# EAGLE design Zio Qwiic LoRa Module (EAGLE 9.2.2)
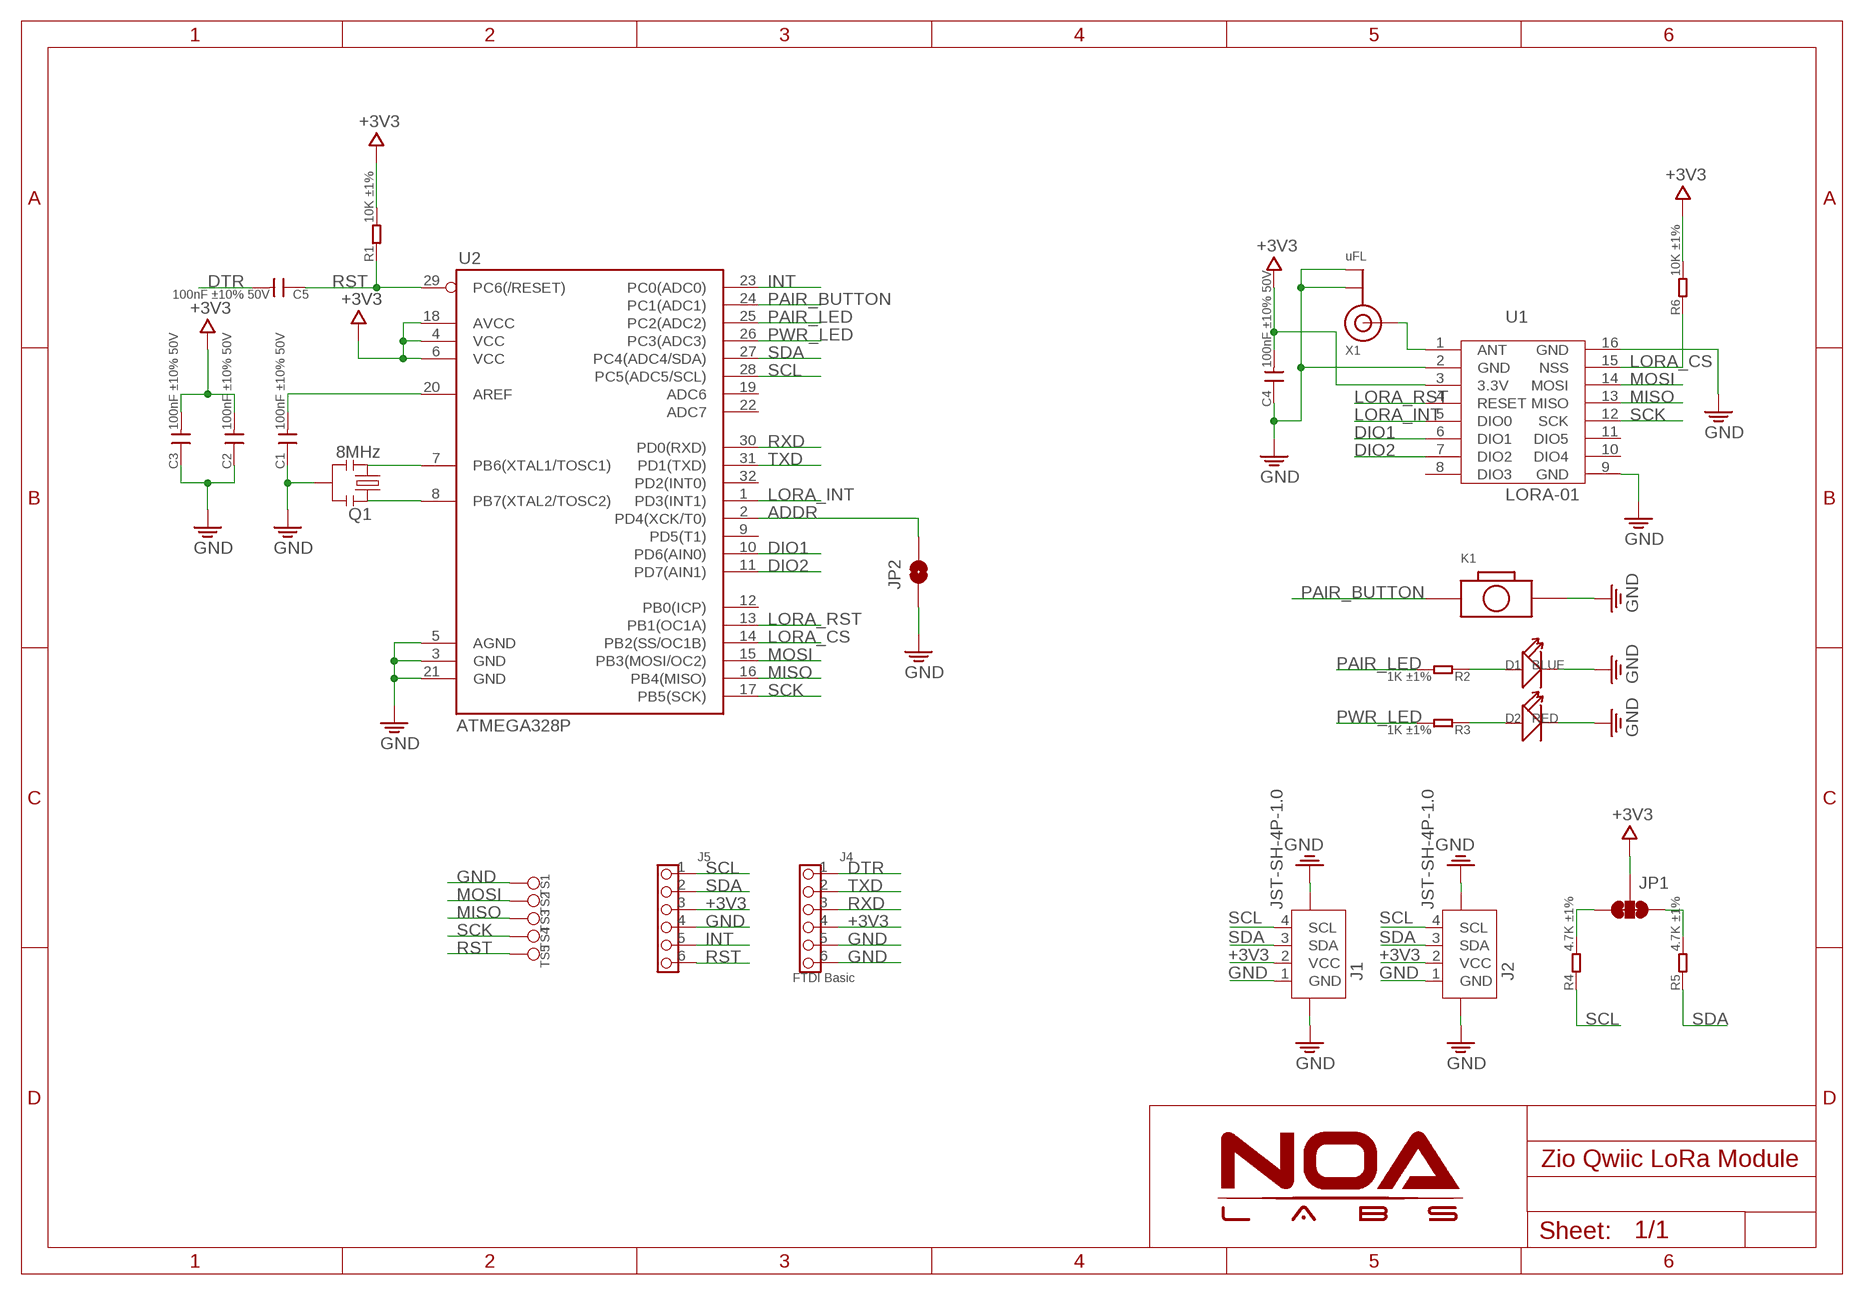
[diagram p0: schematic, sheet 1]

## Parts
C1  100nF ±10% 50V  C-0603  [C0603]
C2  100nF ±10% 50V  C-0603  [C0603]
C3  100nF ±10% 50V  C-0603  [C0603]
C4  100nF ±10% 50V  C-0603  [C0603]
C5  100nF ±10% 50V  C-0603  [C0603]
D1  BLUE  LED'0603'  [LED-0603]
D2  RED  LED'0603'  [LED-0603]
J1  JST-SH-4P-1.0  [JST-SH-4P]
J2  JST-SH-4P-1.0  [JST-SH-4P]
J4  FTDI Basic  HEADER-6P-60/35MIL  [6P-2.54-60/35MIL]
J5  HEADER-6P-60/35MIL  [6P-2.54-60/35MIL]
JP1  SMT-JUMPER_3_2-NC_TRACE  [SMT-JUMPER_3_2-NC_TRACE]
JP2  JUMPER-SMT_2_NC_PASTE_NOCREM  [SMT-JUMPER_2_NC_PASTE_SILK_NOCREM]
K1  BOTTON-2PSKRKAEE020  [SKRKAEE020]
Q1  8MHz  RESONATORSMD  [RESONATOR-SMD]
R1  10K ±1%  R-0603  [R0603]
R2  1K ±1%  R-0603  [R0603]
R3  1K ±1%  R-0603  [R0603]
R4  4.7K ±1%  R-0603  [R0603]
R5  4.7K ±1%  R-0603  [R0603]
R6  10K ±1%  R-0603  [R0603]
TS1  TEST_POINT35MIL  [1P-35MIL]
TS2  TEST_POINT35MIL  [1P-35MIL]
TS3  TEST_POINT35MIL  [1P-35MIL]
TS4  TEST_POINT35MIL  [1P-35MIL]
TS5  TEST_POINT35MIL  [1P-35MIL]
U1  LORA-01  [LORA-01]
U2  ATMEGA328P  ATMEGA168  [TQFP32-08]
X1  uFL  ANTENNA_U.FL  [U.FL]

## Nets
+3V3: C2.2 C3.2 C4.2 J1.2(VCC) J2.2(VCC) J4.4 J5.3 JP1.2 R1.2 R6.2 U1.3(3.3V) U2.4(VCC) U2.6(VCC) U2.18(AVCC)
ADDR: JP2.2 U2.2(PD4(XCK/T0))
DIO1: U1.6(DIO1) U2.10(PD6(AIN0))
DIO2: U1.7(DIO2) U2.11(PD7(AIN1))
DTR: C5.2 J4.1
GND: C1.1 C2.1 C3.1 C4.1 D1.- D2.- J1.1(GND) J1.NC1 J1.NC2 J2.1(GND) J2.NC1 J2.NC2 J4.5 J4.6 J5.4 JP2.1 K1.2 Q1.2 TS1.P$1 U1.2(GND) U1.9(GND) U1.16(GND) U2.3(GND) U2.5(AGND) U2.21(GND) X1.1(GND) X1.2(GND)
INT: J5.5 U2.23(PC0(ADC0))
LORA_CS: R6.1 U1.15(NSS) U2.14(PB2(SS/OC1B))
LORA_INT: U1.5(DIO0) U2.1(PD3(INT1))
LORA_RST: U1.4(RESET) U2.13(PB1(OC1A))
MISO: TS3.P$1 U1.13(MISO) U2.16(PB4(MISO))
MOSI: TS2.P$1 U1.14(MOSI) U2.15(PB3(MOSI/OC2))
N$1: D1.+ R2.1
N$2: D2.+ R3.1
N$4: Q1.3 U2.7(PB6(XTAL1/TOSC1))
N$5: Q1.1 U2.8(PB7(XTAL2/TOSC2))
N$6: C1.2 U2.20(AREF)
N$18: U1.1(ANT) X1.3(SIGNAL)
N$34: JP1.3 R4.2
N$36: JP1.1 R5.2
PAIR_BUTTON: K1.1 U2.24(PC1(ADC1))
PAIR_LED: R2.2 U2.25(PC2(ADC2))
PWR_LED: R3.2 U2.26(PC3(ADC3))
RST: C5.1 J5.6 R1.1 TS5.P$1 U2.29(PC6(/RESET))
RXD: J4.3 U2.30(PD0(RXD))
SCK: TS4.P$1 U1.12(SCK) U2.17(PB5(SCK))
SCL: J1.4(SCL) J2.4(SCL) J5.1 R4.1 U2.28(PC5(ADC5/SCL))
SDA: J1.3(SDA) J2.3(SDA) J5.2 R5.1 U2.27(PC4(ADC4/SDA))
TXD: J4.2 U2.31(PD1(TXD))
Unconnected: U1.8(DIO3) U1.10(DIO4) U1.11(DIO5) U2.9(PD5(T1)) U2.12(PB0(ICP)) U2.19(ADC6) U2.22(ADC7) U2.32(PD2(INT0))

## Library data of the parts
C1-C5 = RCL:C
D1 D2 = Discrete_NOA:LED*
J1 J2 = Connector:JST-SH-4P
J4 J5 = Connector_NOA:HEADER-6P
JP1 = NOA-Jumpers:SMT-JUMPER_3_2-NC_TRACE
JP2 = NOA-Jumpers:JUMPER-SMT_2_NC_PASTE_NOCREM
K1 = Discrete:BOTTON-2P
Q1 = SparkFun:RESONATOR: Resonator Small SMD resonator. This is the itty bitty 10/20MHz resonators with built in caps. CSTCE10M0G55 and CSTCE20M0V53. Footprint has been reviewed closely but hasn't been tested yet.
R1-R6 = RCL:R
TS1-TS5 = Connector:TEST_POINT
U1 = IC:LORA-01
U2 = SparkFun:ATMEGA168
X1 = microbuilder:ANTENNA_U.FL: U.FL Antenna Connector

## Board
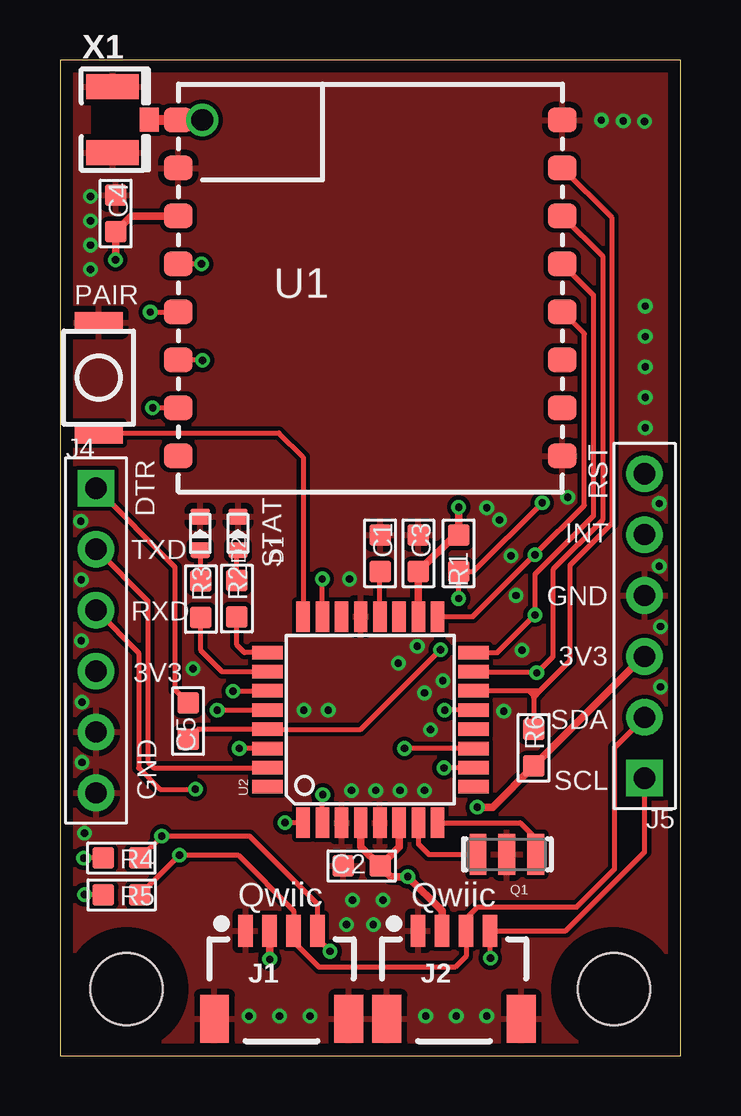
[diagram p1: board, top side]
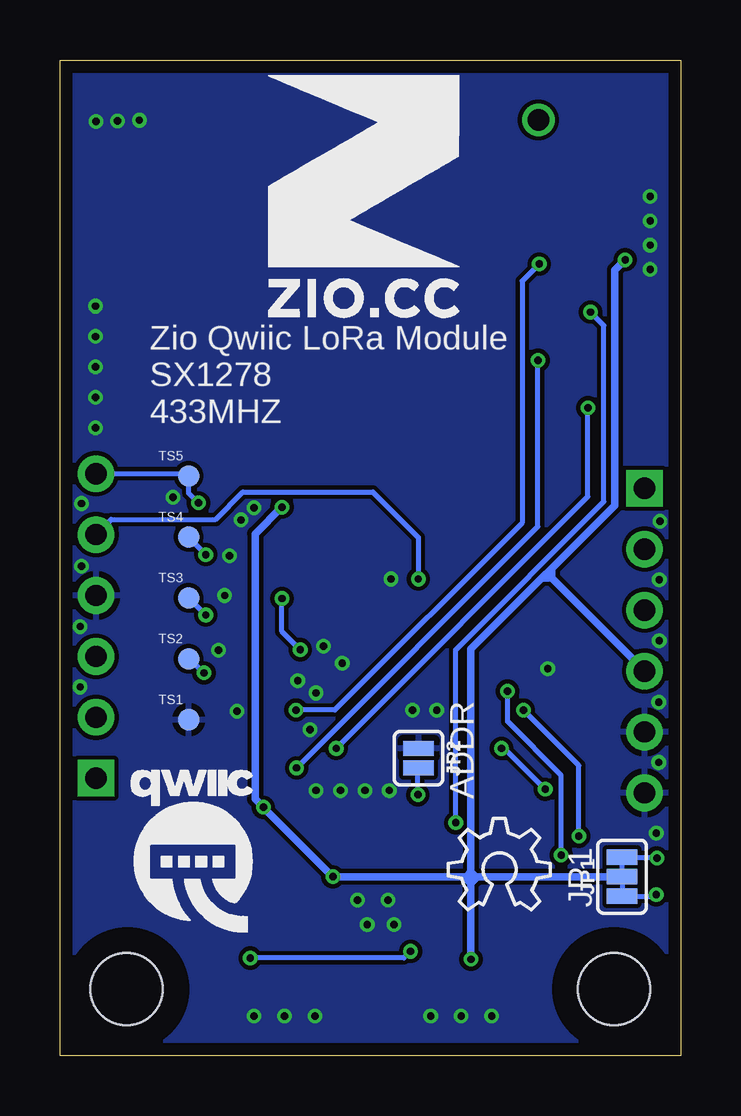
[diagram p2: board, bottom side, seen from below]

Size 25.86 x 41.5 mm. Coordinates in mm from the lower left corner, seen from the top.
Outline: 0,0 25.86,0 25.86,41.5 0,41.5 0,0
Copper layers (1*16): Top 0.035mm / dielectric 1.5mm / Bottom 0.035mm
Design rules "NOA Eagle Rule": minimum track width 7mil, minimum drill 12mil, track to track 7mil, track to pad 7mil, pad to pad 7mil, via to via 7mil, smd to smd 0mil, copper to edge 20mil, drill to drill 10mil, minimum pad ring 10mil, minimum via ring 6mil, stop-mask expansion 2mil, vias tented up to drill 25mil, thermal gap 10mil
Holes 3 mm at 2.77,2.77 23.09,2.77
tRestrict: area 0.3,0.3 to 5.3,5.3; area 20.6,0.3 to 25.6,5.3
bRestrict: area 0.3,0.3 to 5.3,5.3; area 20.6,0.3 to 25.6,5.3

### Footprints (pad centres in the part's own frame; a part is rotated, then mirrored left to right if it is on the bottom)
C0603 = smd 0.889 x 0.889: 1 -0.762,0; 2 0.762,0
LED-0603 = smd 0.635 x 0.8: + 0.699,0; - -0.699,0
JST-SH-4P = smd 0.6 x 1.35: 1 1.5,0; 2 0.5,0; 3 -0.5,0; 4 -1.5,0 | smd 1.2 x 2: NC1 -2.8,3.675; NC2 2.8,3.675
6P-2.54-60/35MIL = drill 0.889 pad 1.524 square: 1 0,6.35 | drill 0.889 pad 1.524: 2 0,3.81; 3 0,1.27; 4 0,-1.27; 5 0,-3.81; 6 0,-6.35
SMT-JUMPER_3_2-NC_TRACE = smd 0.635 x 1.27: 1 -0.813,0; 2 0,0; 3 0.813,0
SMT-JUMPER_2_NC_PASTE_SILK_NOCREM = smd 0.635 x 1.27: 1 -0.406,0; 2 0.406,0
SKRKAEE020 = smd 0.87 x 2: 1 -2.3,0; 2 2.3,0
RESONATOR-SMD = smd 0.7 x 1.7: 1 -1.2,0; 2 0,0; 3 1.2,0
R0603 = smd 0.889 x 0.889: 1 -0.762,0; 2 0.762,0
1P-35MIL = smd 0.889 x 0.889: P$1 0,0
LORA-01 = smd 1.2 x 1: 1 -8,7; 2 -8,5; 3 -8,3; 4 -8,1; 5 -8,-1; 6 -8,-3; 7 -8,-5; 8 -8,-7; 9 8,-7; 10 8,-5; 11 8,-3; 12 8,-1; 13 8,1; 14 8,3; 15 8,5; 16 8,7
TQFP32-08 = smd 1.27 x 0.559: 1 -4.293,2.8; 2 -4.293,2; 3 -4.293,1.2; 4 -4.293,0.4; 5 -4.293,-0.4; 6 -4.293,-1.2; 7 -4.293,-2; 8 -4.293,-2.8; 17 4.293,-2.8; 18 4.293,-2; 19 4.293,-1.2; 20 4.293,-0.4; 21 4.293,0.4; 22 4.293,1.2; 23 4.293,2; 24 4.293,2.8 | smd 0.559 x 1.27: 9 -2.8,-4.293; 10 -2,-4.293; 11 -1.2,-4.293; 12 -0.4,-4.293; 13 0.4,-4.293; 14 1.2,-4.293; 15 2,-4.293; 16 2.8,-4.293; 25 2.8,4.293; 26 2,4.293; 27 1.2,4.293; 28 0.4,4.293; 29 -0.4,4.293; 30 -1.2,4.293; 31 -2,4.293; 32 -2.8,4.293
U.FL = smd 2.2 x 1.05: 1 0,1.375; 2 0,-1.375 | smd 0.8 x 1: 3 1.525,0

### Placement (x,y rotation side)
C1  13.34,20.93 270 top
C2  12.57,7.9 0 top
C3  14.94,20.93 270 top
C4  2.32,35.1 270 top
C5  5.33,13.94 90 top
D1  7.42,21.77 270 top
D2  5.84,21.77 270 top
J1  9.23,5.2 180 top
J2  16.42,5.2 180 top
J4  1.5,17.3 0 top
J5  24.36,17.91 180 top
JP1  2.44,7.45 90 bottom
JP2  10.92,12.4 270 bottom
K1  1.61,28.25 90 top
Q1  18.62,8.38 180 top
R1  16.61,20.93 90 top
R2  7.37,19.05 270 top
R3  5.87,19.02 270 top
R4  2.56,8.23 180 top
R5  2.56,6.7 180 top
R6  19.74,12.83 270 top
TS1  20.5,14 0 bottom
TS2  20.5,16.54 0 bottom
TS3  20.5,19.08 0 bottom
TS4  20.5,21.62 0 bottom
TS5  20.5,24.16 0 bottom
U1  12.93,32 0 top
U2  12.93,14 90 top
U$10  [10MM]  17.2,30.78 0 bottom
U$11  [QWIIC-LOGO-MEDIUM]  20.37,8.59 0 bottom
U$12  [OSHW_6X150_NOTEXT]  9.68,6.07 0 bottom
X1  2.19,39.01 0 top

### Tracks (layer width: path | path; a pad name or v marks a point on that pad's centre or on a via)
+3V3  (via drill 0.3)
  Top 0.305: U2.4 12.53,8.7 C2.2 | U2.6 14.13,8.69 C2.2 | U2.18 C3.2 16.46,21.69 R1.2 v16.61,22.86 | U1.3 2.98,35 C4.2 v2.32,33.18 v2.31,33.17 | J1.2 v8.73,4.02 v8.74,4.01 | J2.2 15.92,6.02 v14.49,7.45 13.78,7.45 C2.2 | v17.39,10.35 18.02,10.35 R6.2 24.31,16.64 J5.3
  Bottom 0.305: JP1.2 8.53,7.45 | 8.53,7.45 8.94,7.45 | v8.74,4.01 8.74,7.17 | 8.74,7.17 9.02,7.45 | 8.74,7.17 8.53,7.38 8.53,7.45 | 9.02,7.45 v14.49,7.45 v17.39,10.35 17.73,10.69 17.73,21.74 v16.61,22.86 | v2.31,33.17 2.74,32.74 2.74,22.93 5.37,20.31 | 8.74,7.66 8.53,7.45 | 5.37,20.31 5.78,19.9 | 5.78,19.9 8.74,16.94 8.74,7.66 | 8.74,7.66 8.94,7.45 | 8.94,7.45 9.02,7.45 | J4.4 5.37,19.9 | 5.37,19.9 5.37,20.31 | 5.37,19.9 5.78,19.9
ADDR  (via drill 0.3)
  Top 0.203: U2.2 10.93,10.85 v10.95,10.87
  Bottom 0.203: v10.95,10.87 10.95,11.96 JP2.2
DIO1  (via drill 0.3)
  Top 0.203: U2.10 16.01,12 v16,11.99 | v5.94,28.98 5.92,29 U1.6
  Bottom 0.203: v16,11.99 5.94,22.05 v5.94,28.98
DIO2  (via drill 0.3)
  Top 0.203: U2.11 v14.35,12.8 | v3.86,27 U1.7 | U1.7
  Bottom 0.203: v14.35,12.8 3.86,23.29 v3.86,27
DTR
  Top 0.203: J4.1 4.8,20.35 4.8,15.24 C5.2
GND  (via drill 0.3)
  other vias: 1.02,9.27 0.91,12.22 0.91,14.73 0.89,17.3 0.86,22.28 24.97,23.01 24.97,20.4 25.02,17.88 25.02,15.37 24.38,26.16 0.89,19.84 12.14,11.05 13.16,11.05 14.17,11.05 15.19,11.05 15.44,13.59 18.49,14.35 19.25,16.89 19,19.18 5.54,16.13 15.95,15.62 15.19,15.11 17.78,22.83 18.31,22.33 18.8,20.83 21.16,23.27 12.06,19.86 24.38,27.43 24.38,28.7 24.38,29.97 24.38,31.24 1.27,35.81 1.27,34.8 1.27,33.78 1.27,32.77 7.87,1.65 9.14,1.65 10.41,1.65 15.24,1.65 16.51,1.65 17.78,1.65 12.19,6.48 13.46,6.48 13.06,5.46 11.94,5.46 14.88,17.07 14.1,16.36 10.16,14.4 11.18,14.4 22.56,38.99 23.47,38.96 24.36,38.94
  pour Top: 0,41.5 25.86,41.5 25.86,0 0,0
  pour Bottom: 0,41.5 25.86,41.5 25.86,0 0,0
INT  (via drill 0.3)
  Top 0.203: U2.23 v10.93,19.86
  Bottom 0.203: J5.5 23.73,22.35 19.38,22.35 18.24,23.5 12.83,23.5 10.93,21.6 v10.93,19.86
LORA_CS
  Top 0.203: 19.99,15.19 19.56,15.19 | 19.56,15.19 17.23,15.19 U2.14 | U1.15 22.99,34.94 22.99,22.18 21.25,20.43 21.25,16.45 19.99,15.19 | 19.99,15.19 19.74,14.94 | 19.74,14.94 R6.1 | 19.74,14.94 19.74,15.01 19.56,15.19
LORA_INT  (via drill 0.3)
  Top 0.203: U2.1 v9.38,9.71 v9.37,9.7 | v3.76,30.99 3.77,31 U1.5
  Bottom 0.203: v9.37,9.7 9.37,16.92 3.2,23.09 3.2,30.43 v3.76,30.99
LORA_RST  (via drill 0.3)
  Top 0.203: U2.13 v16.03,14.4 | v5.89,32.99 v5.89,33 U1.4
  Bottom 0.203: v16.03,14.4 14.4,14.4 6.6,22.2 6.6,32.28 v5.89,32.99
MISO  (via drill 0.3)
  Top 0.203: U2.16 18.22,16.8 v19.79,18.36 19.79,20.05 22.23,22.49 22.23,31.7 U1.13
  Bottom 0.203: v19.79,18.36 TS3.P$1
MOSI  (via drill 0.3)
  Top 0.203: U2.15 19.81,16 v19.86,15.95 20.53,16.62 20.53,20.26 22.61,22.33 22.61,33.32 U1.14
  Bottom 0.203: v19.86,15.95 20.45,16.54 TS2.P$1
N$1
  Top 0.203: R2.1 7.37,21.02 D1.+
N$2
  Top 0.203: R3.1 5.87,21.04 D2.+
N$4
  Top 0.203: U2.7 14.93,8.82 15.37,8.38 Q1.3
N$5
  Top 0.203: U2.8 19.17,9.71 19.82,9.06 Q1.1
N$6
  Top 0.203: U2.20 C1.2
N$18  (via drill 0.9)
  Top 0.406: X1.3 3.72,39 U1.1 5.65,39 v5.93,39
N$34  (via drill 0.3)
  Top 0.203: R4.2 v0.99,8.23
  Bottom 0.203: JP1.3 1.03,8.27 v0.99,8.23
N$36  (via drill 0.3)
  Top 0.203: R5.2 1.02,6.7 v1.02,6.71
  Bottom 0.203: JP1.1 1.08,6.64 v1.02,6.71
PAIR_BUTTON
  Top 0.203: U2.24 10.13,24.95 9.12,25.95 K1.1
PAIR_LED
  Top 0.203: U2.25 7.69,16.8 7.37,17.12 R2.2
PWR_LED
  Top 0.203: U2.26 6.76,16 5.87,16.89 R3.2
RST  (via drill 0.3)
  Top 0.203: v15.85,16.92 12.53,13.6 U2.29 5.75,13.6 C5.1 | v16.61,19.05 R1.1 17.22,20.17 v20.09,23.04
  Bottom 0.203: v15.85,16.92 16.61,17.68 v16.61,19.05 | v20.09,23.04 20.5,23.45 TS5.P$1 20.6,24.26 J5.6
RXD  (via drill 0.3)
  Top 0.203: U2.30 v7.47,12.8 | J4.3 3.28,16.79 3.28,11.99 4.17,11.1 v5.64,11.1
  Bottom 0.203: v5.64,11.1 7.34,12.8 v7.47,12.8
SCK  (via drill 0.3)
  Top 0.203: U2.17 17.2,18.29 v19.79,20.88 21.84,22.94 21.84,30.09 U1.12
  Bottom 0.203: v19.79,20.88 20.5,21.59 TS4.P$1
SCL  (via drill 0.3)
  Top 0.203: v11.25,4.34 10.73,4.86 J1.4 10.73,6.31 7.9,9.14 v4.24,9.14 R4.1 | v17.93,4.06 17.93,5.19 J2.4 21.07,5.2 24.36,8.48 J5.1 | v6.55,14.4 U2.28
  Bottom 0.203: v11.25,4.34 11.53,4.06 v17.93,4.06 | v4.24,9.14 4.24,12.09 v6.55,14.4
SDA  (via drill 0.3)
  Top 0.203: R5.1 v4.98,8.35 v4.98,8.36 7.42,8.36 9.73,6.04 J1.3 9.73,4.74 10.79,3.68 16.46,3.68 16.92,4.14 J2.3 16.92,5.72 17.4,6.2 21.53,6.2 23.11,7.78 23.11,12.85 J5.2 | v7.21,15.19 7.22,15.2 U2.27
  Bottom 0.203: v4.98,8.36 4.98,11.68 7.21,13.92 v7.21,15.19
TXD
  Top 0.203: J4.2 3.66,18.95 3.66,12.24 3.9,12 U2.31

### Text on the board
tPlace: PAIR | DTR | RST | INT | TXD | STAT | GND | RXD | 3V3 | 3V3 | SDA | GND | SCL | Qwiic | Qwiic
bPlace: Zio Qwiic LoRa Module / SX1278 / 433MHZ | ADDR | JP1